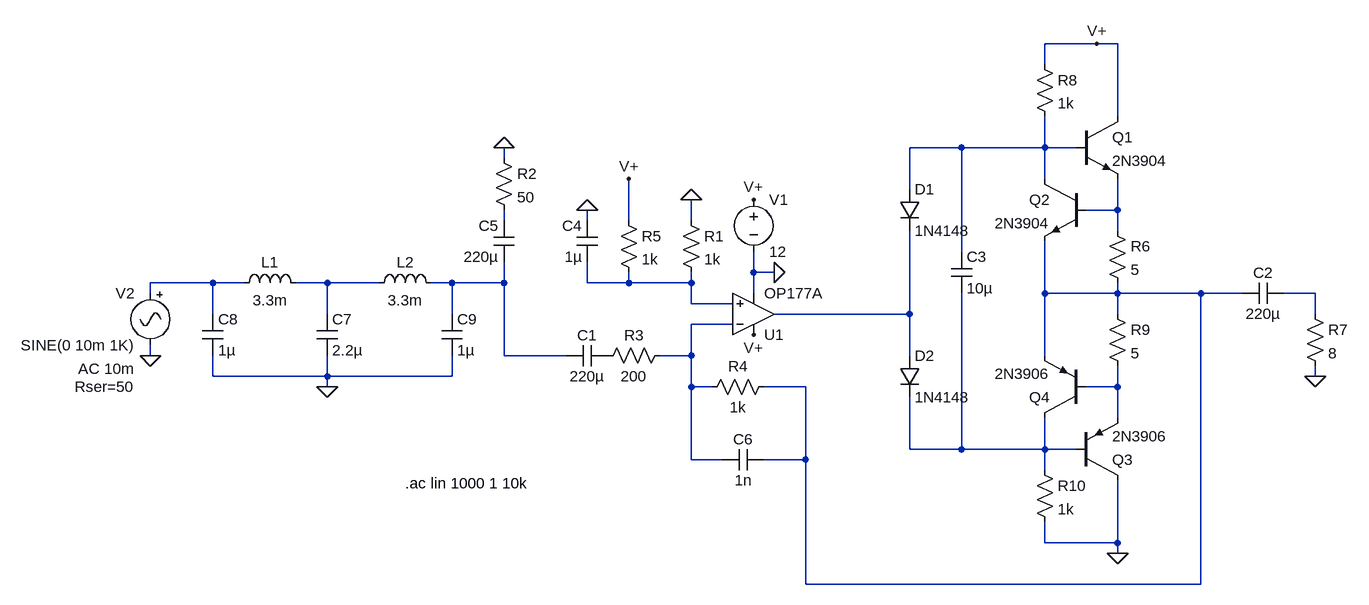
[diagram p0: schematic audio.asc]
audio.asc, the LTspice schematic file:
Version 4
SHEET 1 1240 692
WIRE 704 -144 624 -144
WIRE 736 -144 704 -144
WIRE 624 -112 624 -144
WIRE 736 -32 736 -144
WIRE 496 16 416 16
WIRE 624 16 624 -32
WIRE 624 16 496 16
WIRE 672 16 624 16
WIRE -208 32 -208 16
WIRE 624 64 624 16
WIRE 416 80 416 16
WIRE 736 112 736 64
WIRE 736 112 688 112
WIRE -208 128 -208 112
WIRE -80 128 -80 112
WIRE -16 128 -16 64
WIRE 80 128 80 96
WIRE 736 144 736 112
WIRE 496 176 496 16
WIRE 176 208 176 176
WIRE 208 208 176 208
WIRE -656 224 -752 224
WIRE -608 224 -656 224
WIRE -480 224 -528 224
WIRE -400 224 -480 224
WIRE -288 224 -320 224
WIRE -208 224 -208 192
WIRE -208 224 -288 224
WIRE -80 224 -80 192
WIRE -16 224 -16 208
WIRE -16 224 -80 224
WIRE 80 224 80 208
WIRE 80 224 -16 224
WIRE -752 240 -752 224
WIRE 176 240 176 208
WIRE 624 240 624 160
WIRE 736 240 736 224
WIRE 736 240 624 240
WIRE 864 240 736 240
WIRE 928 240 864 240
WIRE 1040 240 992 240
WIRE 80 256 80 224
WIRE 144 256 80 256
WIRE -656 272 -656 224
WIRE -480 272 -480 224
WIRE -288 272 -288 224
WIRE 416 272 416 144
WIRE 416 272 208 272
WIRE 736 272 736 240
WIRE 1040 272 1040 240
WIRE 144 288 80 288
WIRE -752 336 -752 320
WIRE -208 336 -208 224
WIRE -112 336 -208 336
WIRE 80 336 80 288
WIRE 80 336 32 336
WIRE 416 336 416 272
WIRE 624 336 624 240
WIRE -656 368 -656 336
WIRE -480 368 -480 336
WIRE -480 368 -656 368
WIRE -288 368 -288 336
WIRE -288 368 -480 368
WIRE 1040 368 1040 352
WIRE -480 384 -480 368
WIRE 80 384 80 336
WIRE 112 384 80 384
WIRE 256 384 192 384
WIRE 736 384 736 352
WIRE 736 384 688 384
WIRE 736 432 736 384
WIRE 416 480 416 400
WIRE 496 480 496 240
WIRE 496 480 416 480
WIRE 624 480 624 432
WIRE 624 480 496 480
WIRE 672 480 624 480
WIRE 80 496 80 384
WIRE 128 496 80 496
WIRE 256 496 256 384
WIRE 256 496 192 496
WIRE 624 512 624 480
WIRE 624 624 624 592
WIRE 736 624 736 528
WIRE 736 624 624 624
WIRE 736 640 736 624
WIRE 256 688 256 496
WIRE 864 688 864 240
WIRE 864 688 256 688
FLAG 80 96 0
FLAG 208 208 0
FLAG 176 96 V+
FLAG 176 304 V+
FLAG -16 64 V+
FLAG 1040 368 0
FLAG -752 336 0
FLAG 736 640 0
FLAG 704 -144 V+
FLAG -208 16 0
FLAG -80 112 0
FLAG -480 384 0
SYMBOL Opamps\\OP177A 176 336 M180
SYMATTR InstName U1
SYMBOL res 64 112 R0
SYMATTR InstName R1
SYMATTR Value 1k
SYMBOL res -64 352 R270
WINDOW 0 32 56 VTop 2
WINDOW 3 0 56 VBottom 2
SYMATTR InstName R3
SYMATTR Value 200
SYMBOL res 96 400 R270
WINDOW 0 32 56 VTop 2
WINDOW 3 0 56 VBottom 2
SYMATTR InstName R4
SYMATTR Value 1k
SYMBOL voltage 176 80 R0
WINDOW 123 0 0 Left 0
WINDOW 39 0 0 Left 0
SYMATTR InstName V1
SYMATTR Value 12
SYMBOL res -32 112 R0
SYMATTR InstName R5
SYMATTR Value 1k
SYMBOL cap -48 320 R90
WINDOW 0 0 32 VBottom 2
WINDOW 3 32 32 VTop 2
SYMATTR InstName C1
SYMATTR Value 220µ
SYMBOL cap 992 224 R90
WINDOW 0 0 32 VBottom 2
WINDOW 3 32 32 VTop 2
SYMATTR InstName C2
SYMATTR Value 220µ
SYMBOL res 1024 256 R0
SYMATTR InstName R7
SYMATTR Value 8
SYMBOL Misc\\signal -752 224 M0
WINDOW 123 24 132 Left 2
WINDOW 39 24 160 Left 2
SYMATTR InstName V2
SYMATTR Value SINE(0 10m 1K)
SYMATTR Value2 AC 10m
SYMATTR SpiceLine Rser=50
SYMBOL npn 672 -32 R0
SYMATTR InstName Q1
SYMATTR Value 2N3904
SYMBOL npn 688 64 M0
SYMATTR InstName Q2
SYMATTR Value 2N3904
SYMBOL res 720 128 R0
SYMATTR InstName R6
SYMATTR Value 5
SYMBOL res 608 -128 R0
SYMATTR InstName R8
SYMATTR Value 1k
SYMBOL diode 400 80 R0
SYMATTR InstName D1
SYMATTR Value 1N4148
SYMBOL cap 480 176 R0
SYMATTR InstName C3
SYMATTR Value 10µ
SYMBOL res 720 256 R0
SYMATTR InstName R9
SYMATTR Value 5
SYMBOL pnp 672 528 M180
SYMATTR InstName Q3
SYMATTR Value 2N3906
SYMBOL pnp 688 432 R180
SYMATTR InstName Q4
SYMATTR Value 2N3906
SYMBOL diode 400 336 R0
SYMATTR InstName D2
SYMATTR Value 1N4148
SYMBOL res 608 496 R0
SYMATTR InstName R10
SYMATTR Value 1k
SYMBOL cap -192 192 R180
WINDOW 0 24 56 Left 2
WINDOW 3 24 8 Left 2
SYMATTR InstName C5
SYMATTR Value 220µ
SYMBOL res -224 16 R0
SYMATTR InstName R2
SYMATTR Value 50
SYMBOL cap -64 192 R180
WINDOW 0 24 56 Left 2
WINDOW 3 24 8 Left 2
SYMATTR InstName C4
SYMATTR Value 1µ
SYMBOL cap 192 480 R90
WINDOW 0 0 32 VBottom 2
WINDOW 3 32 32 VTop 2
SYMATTR InstName C6
SYMATTR Value 1n
SYMBOL ind -624 240 R270
WINDOW 0 32 56 VTop 2
WINDOW 3 5 56 VBottom 2
SYMATTR InstName L1
SYMATTR Value 3.3m
SYMBOL cap -496 272 R0
SYMATTR InstName C7
SYMATTR Value 2.2µ
SYMBOL cap -672 272 R0
SYMATTR InstName C8
SYMATTR Value 1µ
SYMBOL ind -416 240 R270
WINDOW 0 32 56 VTop 2
WINDOW 3 5 56 VBottom 2
SYMATTR InstName L2
SYMATTR Value 3.3m
SYMBOL cap -304 272 R0
SYMATTR InstName C9
SYMATTR Value 1µ
TEXT -360 532 Left 2 !.ac lin 1000 1 10k

The netlist it stands for:
* audio.asc
XU1 N007 N011 V+ 0 N010 OP177A  ; pins In+ In- V+ V- OUT
R1 0 N007 1k
R3 P001 N011 200
R4 N011 N008 1k
V1 V+ 0 12
R5 V+ N007 1k
C1 P001 N006 220µ
C2 N009 N008 220µ
R7 N009 0 8
V2 N004 0 SINE(0 10m 1K) AC 10m Rser=50
Q1 V+ N001 N002 0 2N3904
Q2 N001 N002 N008 0 2N3904
R6 N002 N008 5
R8 V+ N001 1k
D1 N001 N010 1N4148
C3 N001 N013 10µ
R9 N008 N012 5
Q3 0 N013 N012 0 2N3906
Q4 N013 N012 N008 0 2N3906
D2 N010 N013 1N4148
R10 N013 0 1k
C5 N006 N003 220µ
R2 0 N003 50
C4 N007 0 1µ
C6 N008 N011 1n
L1 N004 N005 3.3m
C7 N005 0 2.2µ
C8 N004 0 1µ
L2 N005 N006 3.3m
C9 N006 0 1µ
.model D D
.lib standard.dio
.model NPN NPN
.model PNP PNP
.lib standard.bjt
.ac lin 1000 1 10k
.backanno
.end